# Altium schematic sheet 24VloadSwitch.SchDoc
size A4; SheetNumber: 12; SheetTotal: 13
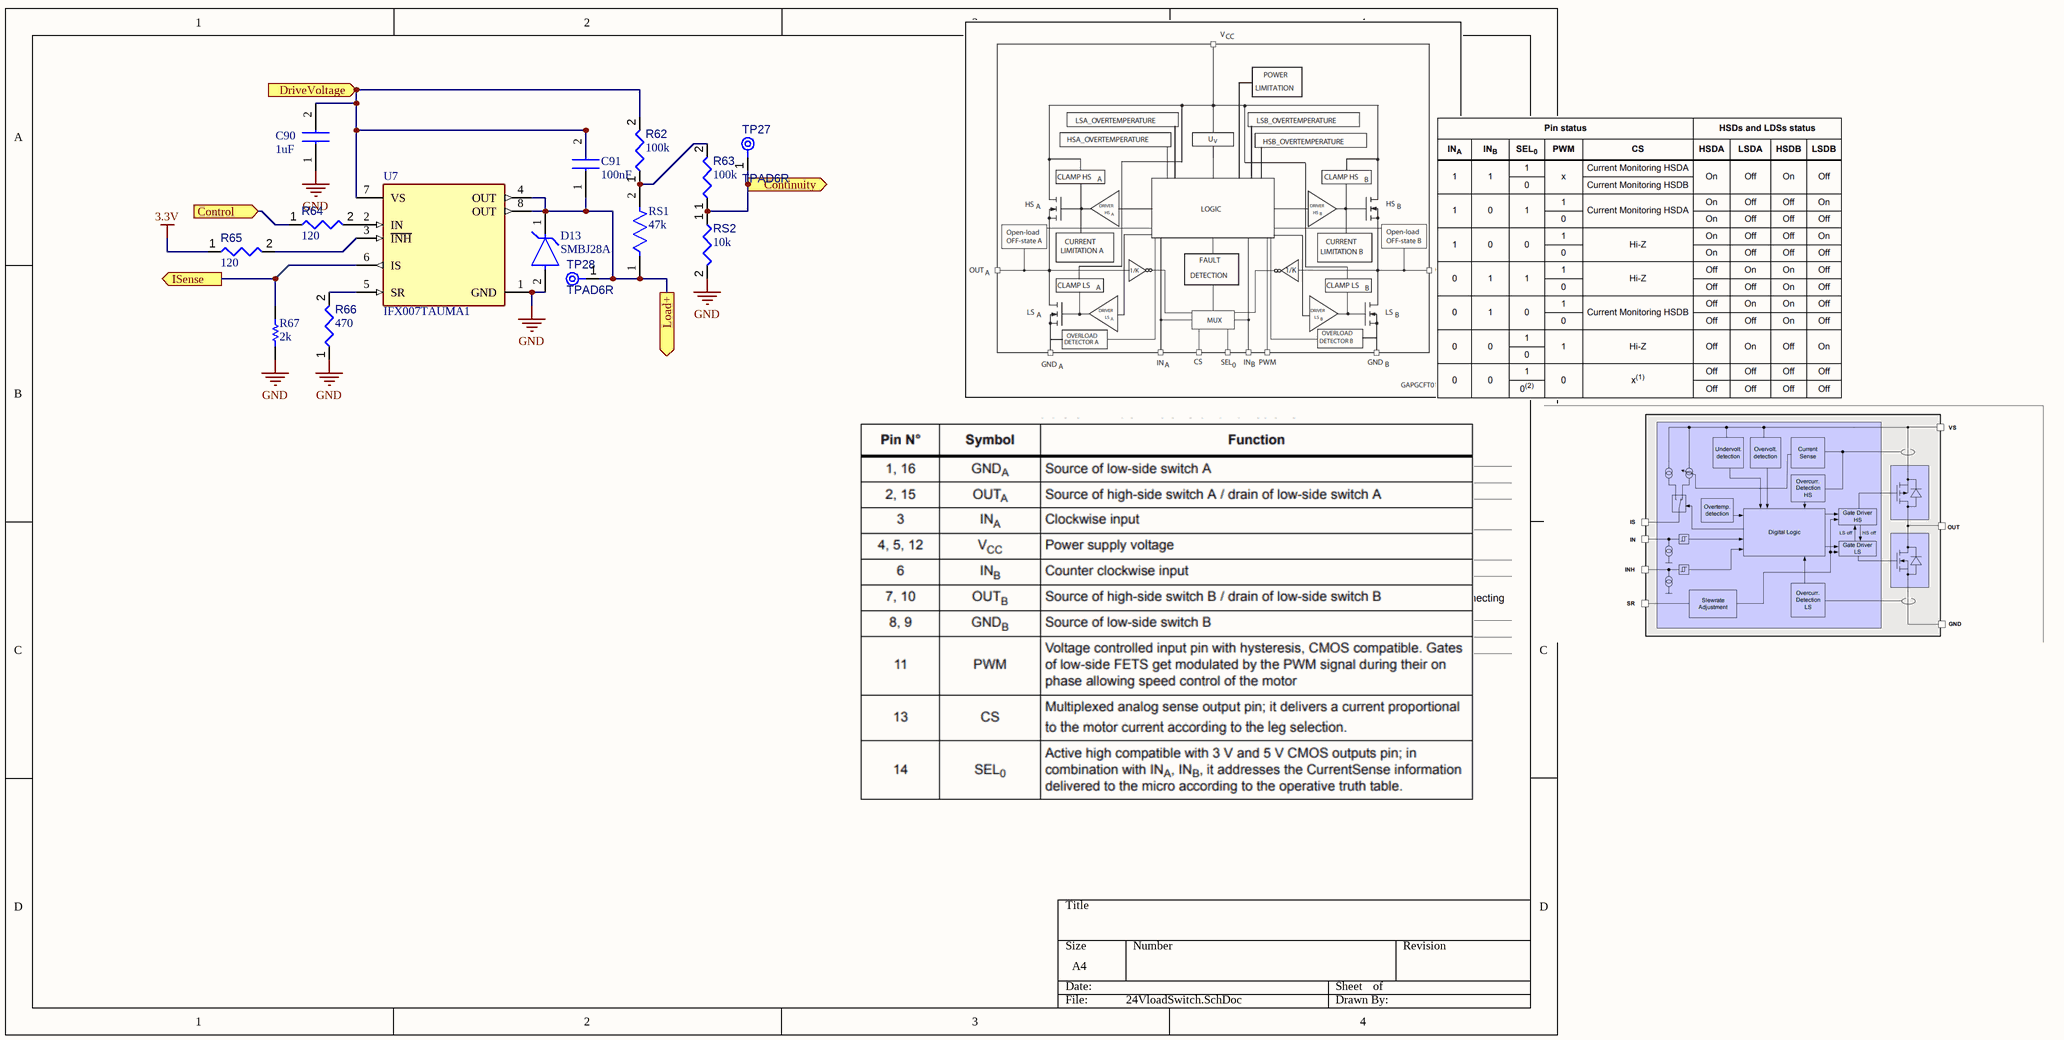
[diagram p0: 24VloadSwitch.SchDoc]

## Parts
C90  1uF  [CAPC3216X180N]
C91  100nF  [CAPC1608X90N]
D13  SMBJ28A  [FP-SMBJ-MFG]
R62  value 100k  [RESC1608X55X25ML10T15]  (hidden comment: Resistor 100k +/-1% 0603 100 mW)
R63  value 100k  [RESC1608X55X25ML10T15]  (hidden comment: Resistor 100k +/-1% 0603 100 mW)
R64  value 120  [RESC0603(1608)_L]  (hidden comment: Resistor 120R +/-5 % 0603 0.1 W)
R65  value 120  [RESC0603(1608)_L]  (hidden comment: Resistor 120R +/-5 % 0603 0.1 W)
R66  value 470  [RESC0805(2012)_L]  (hidden comment: 470R5J)
R67  2k  [RESC1609X50X30ML10T20]
RS1  47k  [FP-CRCW0603-e3-IPC_B]
RS2  value 10k  [RESC0402(1005)_L]  (hidden comment: 10KR2F)
TP27  TPAD6R  [TP06R]  (no BOM)
TP28  TPAD6R  [TP06R]  (no BOM)
U7  IFX007TAUMA1  [FP-PG-TO263-7-MFG]

## Ports
Continuity (out), Control (in), DriveVoltage (in), ISense (out), Load+ (out)

## Nets
3.3V: R65.1
GND: C90.1 D13.2(A) R66.1 R67.1 RS2.2 U7.1(GND)
Continuity: R63.1 RS2.1 TP27.1(TP) ; port Continuity
Control: R64.1 ; port Control
DriveVoltage: C90.2 C91.2 R62.2 U7.7(VS) ; port DriveVoltage
ISense: R67.2 U7.6(IS) ; port ISense
Load+: C91.1 D13.1(C) RS1.1 TP28.1(TP) U7.4(OUT) U7.8(OUT) ; port Load+
NetR62_1: R62.1 R63.2 RS1.2
NetR64_2: R64.2 U7.2(IN)
NetR65_2: R65.2 U7.3(~{INH})
NetR66_2: R66.2 U7.5(SR)

## Library data of the parts
C90 = CL31B105KBHNNNE: 1uF,1206, 50v; Manufacturer_Name: SAMSUNG; Datasheet Link: https://datasheet.datasheetarchive.com/originals/distributors/Datasheets_SAMA/5cd9a1c15dad09a7278f50cb1a2e4a6e.pdf; Height: 1.8mm; Manufacturer_Part_Number: CL31B105KBHNNNE; Mouser Part Number: 187-CL31B105KBHNNNE; Mouser Price/Stock: https://www.mouser.co.uk/ProductDetail/Samsung-Electro-Mechanics/CL31B105KBHNNNE?qs=349EhDEZ59oPJzVuH4J5mw%3D%3D; Arrow Part Number: CL31B105KBHNNNE; Arrow Price/Stock: https://www.arrow.com/en/products/cl31b105kbhnnne/samsung-electro-mechanics?utm_currency=USD&region=europe
C91 = CC0603KRX7R9BB104: Capacitor,0603, 50V; Manufacturer_Name: YAGEO; Datasheet Link: https://componentsearchengine.com/Datasheets/2/CC0603KRX7R9BB104.pdf; Height: 0.9mm; Manufacturer_Part_Number: CC0603KRX7R9BB104; Mouser Part Number: 603-CC603KRX7R9BB104; Mouser Price/Stock: https://www.mouser.co.uk/ProductDetail/YAGEO/CC0603KRX7R9BB104?qs=vTakOoo5QyLvVCYM2ge8LQ%3D%3D; Arrow Part Number: CC0603KRX7R9BB104; Arrow Price/Stock: https://www.arrow.com/en/products/cc0603krx7r9bb104/yageo?utm_currency=USD&region=europe
D13 = CMP-08607-000081-1: TVS DIODE 28V 45.4V DO214AA; Manufacturer: Littelfuse Inc; Breakdown Voltage: 31.1V; Direction: Unidirectional; Number Of Channels: 1; Peak Pulse Power: 600W; Max Junction Temp: +150°C; Peak Pulse Current: 13.3A; Temperature: -65°C to +150°C; Category: Diode; RoHS: TRUE; Height: 2.61mm; Reverse Standoff Voltage: 28V; Device Class L1: Circuit Protection; Temperature Range Low: -65°C; ComponentLink2Description: Datasheet; Digikey Description: TVS DIODE 28V 45.4V DO214AA; Automotive: No; Package: SMBJ; Mouser Description: Littelfuse SMBJ28A, Uni-Directional TVS Diode, 600W, 2-Pin DO-214AA; ComponentLink2URL: https://www.littelfuse.com/~/media/electronics/datasheets/tvs_diodes/littelfuse_tvs_diode_smbj_datasheet.pdf.pdf; Manufacturer Part Number: SMBJ28A; Octopart: https://octopart.com/smbj28a-littelfuse-350790; Clamping Voltage: 45.4V; Temperature Range High: +150°C; Device Class L3: unset; Device Class L2: TVS Diodes; Lead Free: Yes
R62 R63 = CMP-009-00023-5: Chip Resistor, 100 KOhm, +/- 1%, 0.1 W, -55 to 155 degC, 0603 (1608 Metric); Voltage Rating: 50V; Power: 100mW; Max Operating Temperature: 155°C; RoHS Compliant: True; Tolerance: 1%; Pins: 2; Case/Package: 0603; Mounting Technology: SM; Min Operating Temperature: -55°C
R64 R65 = CMP-009-00176-3: Chip Resistor, 120 Ohms, +/-5 %, 0.1 W, -55 to 155 degC, 0603; Power: 100mW; Tolerance: 5%; Max Operating Temperature: 155°C; Pins: 2; Case/Package: 0603; Min Operating Temperature: -55°C
R66 = CMP-009-00102-2: 470R 0.125W 5% 0805 (2012 Metric)  SMD; Power: 125mW; Pins: 2; Case/Package: 0805; Mounting Technology: SMT; Tolerance: 5%
R67 = CMP-2000-03159-1: CRCW06032K00FKEA; Manufacturer: Vishay Dale; Part Number: CRCW06032K00FKEA
RS1 = CMP-2000-03379-3: RES SMD 47K OHM 1% 1/10W 0603 CRCW060347K0FKEA; Voltage Rating: 75V; Max Power Dissipation: 100mW; Resistance: 47kR; Temperature Coefficient: 100ppm/°C; Size Code: 0603; Technology: THICK FILM; Case Code (Metric): 1608; Radiation Hardening: No; Case/Package: 0603; Number of Terminations: 2; Package Quantity: 5000; Width: 0.85mm; Series: CRCW; RoHS Compliant: Yes; Case Code (Imperial): 0603; Lead Free: Lead Free; Resistance Tolerance: 1%; Depth: 0.85mm; Contact Plating: Tin; Tolerance: 1%; Voltage Rating (DC): 75V; Min Operating Temperature: -55°C; Mount: Surface Mount; Packaging: Tape and Reel; Length: 1.55mm; Resistor Type: Thick Film; Features: Automotive AEC-Q200; Max Operating Temperature: 155°C; Weight: 7.1E-05oz; Construction: Rectangular; Height: 0.45mm; Military Standard: Not; Termination: SMD/SMT; Power Rating: 100mW
RS2 = CMP-009-00066-2: 10K 0.063W 1% 0402 (1005 Metric)  SMD; Power: 63mW; Case/Package: 0402; Mounting Technology: SMT; Pins: 2; Tolerance: 1%
TP27 TP28 = CMP-00028-00002-2: 0.6mm round; Pins: 1
U7 = CMP-32854-000005-1: IC HALF-BRIDGE DRVR 2 CH TO263; Manufacturer: Infineon; Number Of Outputs: 1; Nominal Supply Current: 2.3mA; Min Supply Voltage: 8V; Standoff Height: 0.1mm; Max Junction Temp: +150°C; Max Supply Voltage: 40V; Temperature: -40°C to +150°C; ComponentLink2Description: Datasheet; Category: IC; Mouser Description: integrated high current half bridge for motor drive applications; Automotive: No; Digikey Description: IC HALF-BRIDGE DRVR 2 CH TO263; Height: 4.5mm; Package: PG-TO263-7; ComponentLink2URL: https://www.infineon.com/dgdl/Infineon-IFX007T-DS-v01_00-EN.pdf?fileId=5546d46265f064ff0166433484070b75; RoHS: TRUE; Device Class L3: Motor Drivers; Manufacturer Part Number: IFX007TAUMA1; Device Class L2: Power Management ICs; Temperature Range Low: -40°C; Lead Free: Yes; Footprint Url: https://www.infineon.com/cms/en/product/packages/PG-TO263/PG-TO263-7-1/; Octopart: https://octopart.com/ifx007tauma1-infineon-94578162; Temperature Range High: +150°C; Device Class L1: Integrated Circuits (ICs)